# EAGLE design MAX1555_LiPo_Charger_Circuit_Ver02 (EAGLE 5.11)
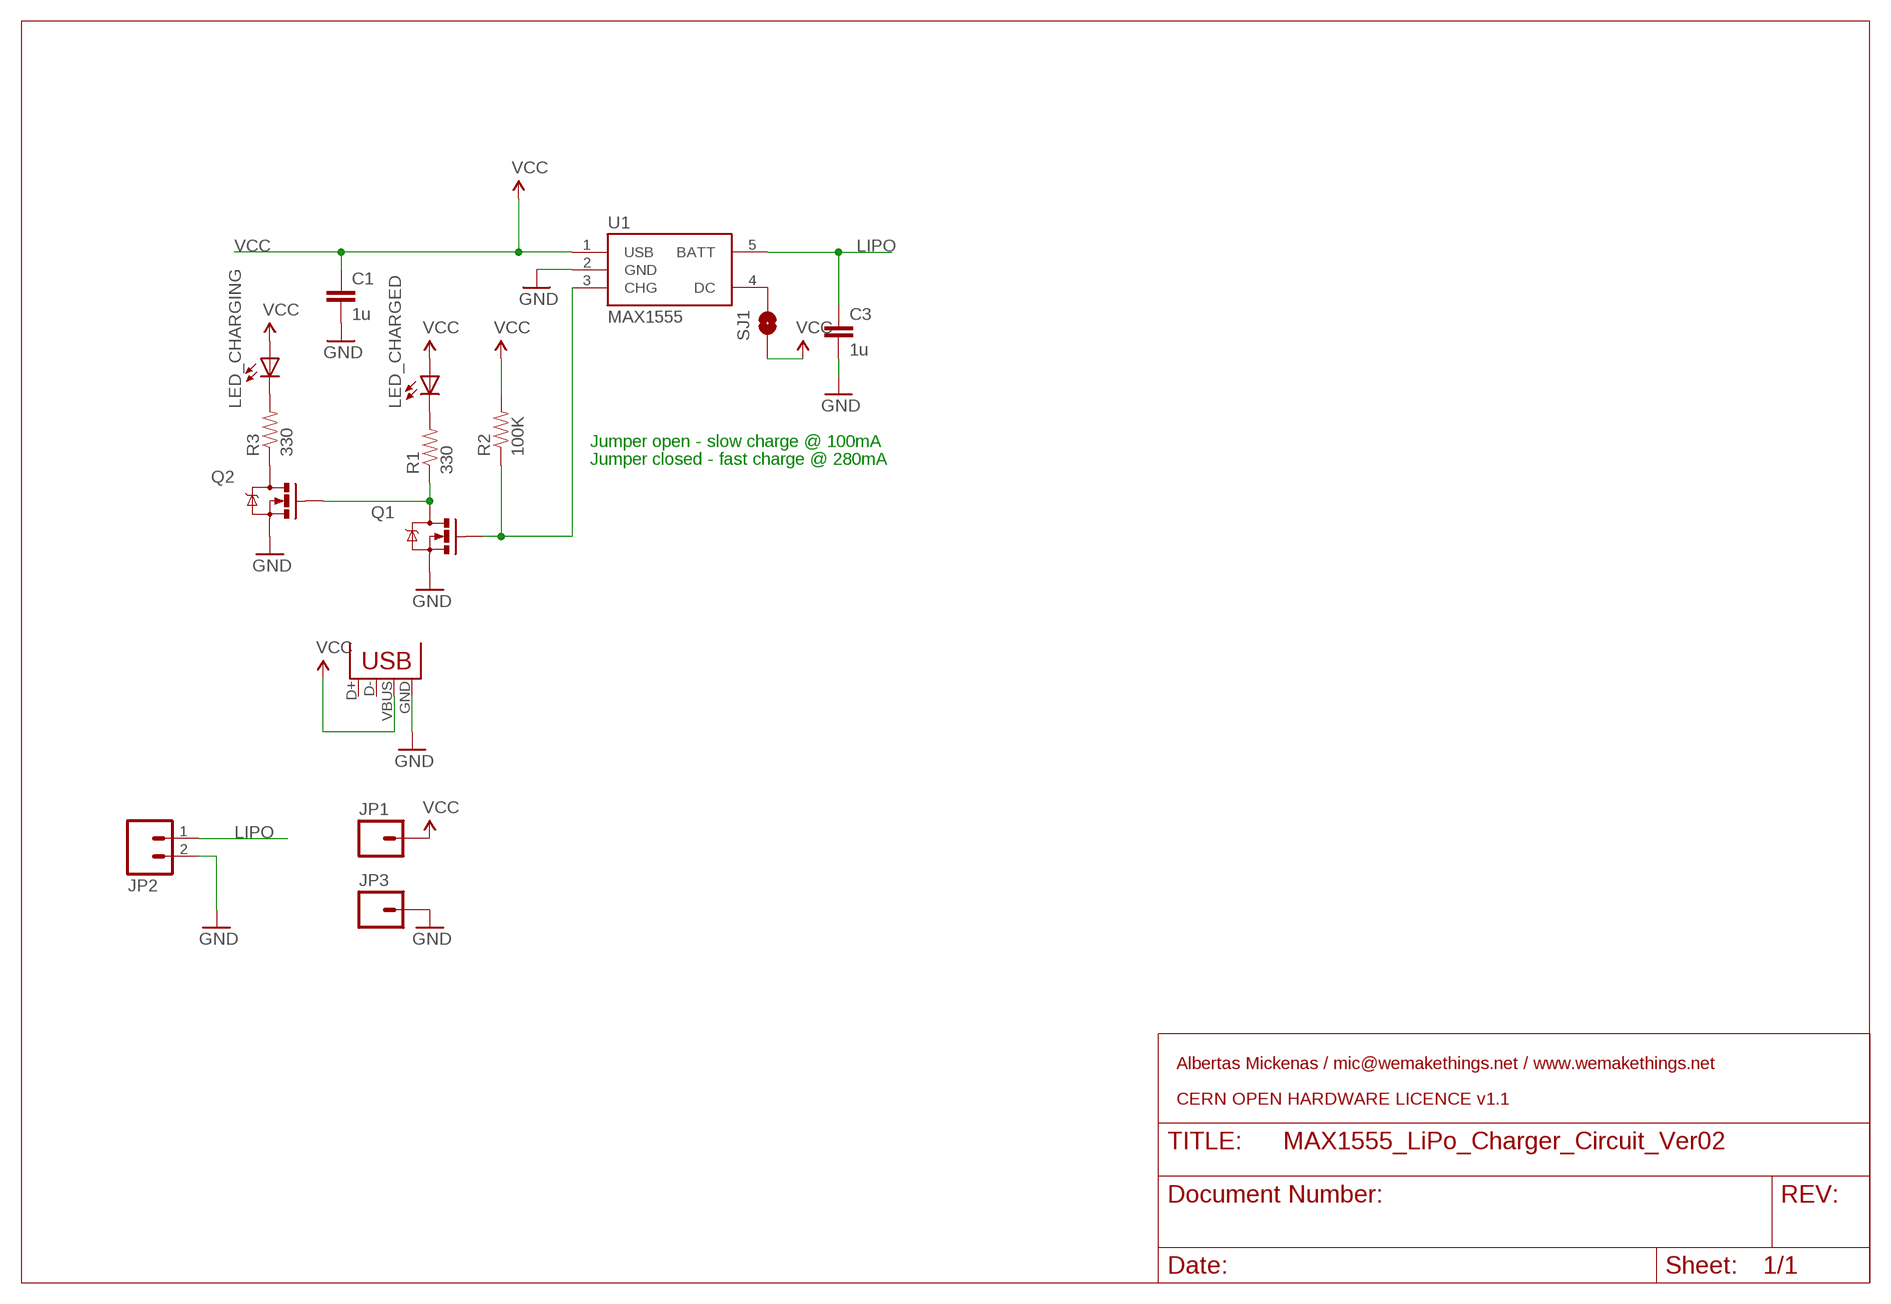
[diagram p0: schematic, sheet 1]

## Parts
C1  1u  CAP0805  [0805]
C3  1u  CAP0805  [0805]
JP1  M01PTH_LONGPAD  [1X01_LONGPAD]
JP2  M02LOCK_LONGPADS  [1X02_LOCK_LONGPADS]
JP3  M01PTH_LONGPAD  [1X01_LONGPAD]
LED_CHARGED  LEDCHIP-LED0805  [CHIP-LED0805]
LED_CHARGING  LEDCHIP-LED0805  [CHIP-LED0805]
Q1  MOSFET-NCHANNELSMD  [SOT23-3]
Q2  MOSFET-NCHANNELSMD  [SOT23-3]
R1  330  RESISTOR0603-RES  [0603-RES]
R2  100K  RESISTOR0603-RES  [0603-RES]
R3  330  RESISTOR0603-RES  [0603-RES]
SJ1  SOLDERJUMPERNC2  [SJ_2S-NOTRACE]
U1  MAX1555  [SOT23-5]
X1  USBOLD  [USB-MINIB-OLD]

## Nets
GND: C1.2 C3.2 JP2.2 JP3.1 Q1.2(S) Q2.2(S) U1.2(GND) X1.GND
LIPO: C3.1 JP2.1 U1.5(BATT)
N$1: Q1.1(G) R2.1 U1.3(CHG)
N$2: Q1.3(D) Q2.1(G) R1.1
N$3: LED_CHARGED.C R1.2
N$4: Q2.3(D) R3.1
N$5: LED_CHARGING.C R3.2
N$6: SJ1.2 U1.4(DC)
VCC: C1.1 JP1.1 LED_CHARGED.A LED_CHARGING.A R2.2 SJ1.1 U1.1(USB) X1.VBUS
Unconnected: X1.D+ X1.D-

## Notes on the sheet
- Jumper open - slow charge @ 100mA
- Jumper closed - fast charge @ 280mA
- Albertas Mickenas / mic@wemakethings.net / www.wemakethings.net
- CERN OPEN HARDWARE LICENCE v1.1

## Library data of the parts
C1 C3 = SparkFun:CAP: Capacitor Standard 0603 ceramic capacitor, and 0.1" leaded capacitor.
JP1 JP3 = SparkFun:M01: Header 1 Standard 1-pin 0.1" header. Use with straight break away headers (SKU : PRT-00116), right angle break away headers (PRT-00553), swiss pins (PRT-00743), machine pins (PRT-00117), and female headers (PRT-00115).
JP2 = SparkFun:M02: Header 2 Standard 2-pin 0.1" header. Use with straight break away headers (SKU : PRT-00116), right angle break away headers (PRT-00553), swiss pins (PRT-00743), machine pins (PRT-00117), and female headers (PRT-00115). Molex polarized connector foot print use with SKU : PRT-08233 with associated crimp pins and housings.
LED_CHARGED LED_CHARGING = adafruit:LED: LED OSRAM: - CHIPLED LG R971, LG N971, LY N971, LG Q971, LY Q971, LO R971, LY R971 LH N974, LH R974 LS Q976, LO Q976, LY Q976 LO Q996 - Hyper CHIPLED LW Q18S LB Q993, LB Q99A, LB R99A - SideLED LS A670, LO A670, LY A670, LG A670, LP A670 LB A673, LV A673, LT A673, LW A673 LH A674 LY A675 LS A676, LA A676, LO A676, LY A676, LW A676 LS A679, LY A679, LG A679 - Hyper Micro SIDELED® LS Y876, LA Y876, LO Y876, LY Y876 LT Y87S - SmartLED LW L88C, LW L88S LB L89C, LB L89S, LG L890 LS L89K, LO L89K, LY L89K LS L896, LA L896, LO L896, LY L896 - TOPLED LS T670, LO T670, LY T670, LG T670, LP T670 LSG T670, LSP T670, LSY T670, LOP T670, LYG T670 LG T671, LOG T671, LSG T671 LB T673, LV T673, LT T673, LW T673 LH T674 LS T676, LA T676, LO T676, LY T676, LB T676, LH T676, LSB T676, LW T676 LB T67C, LV T67C, LT T67C, LS T67K, LO T67K, LY T67K, LW E67C LS E67B, LA E67B, LO E67B, LY E67B, LB E67C, LV E67C, LT E67C LW T67C LS T679, LY T679, LG T679 LS T770, LO T770, LY T770, LG T770, LP T770 LB T773, LV T773, LT T773, LW T773 LH T774 LS E675, LA E675, LY E675, LS T675 LS T776, LA T776, LO T776, LY T776, LB T776 LHGB T686 LT T68C, LB T68C - Hyper Mini TOPLED® LB M676 - Mini TOPLED Santana® LG M470 LS M47K, LO M47K, LY M47K Source: http://www.osram.convergy.de/
Q1 Q2 = SparkFun:MOSFET-NCHANNEL
R1-R3 = SparkFun:RESISTOR: Resistor Basic schematic elements and footprints for 0603, 1206, and PTH resistors.
SJ1 = SparkFun:SOLDERJUMPER: Solder Jumper Standard SMD solder jumper. Used to automate production. Two varients : Normally Open and Normally Closed are the same, but have different paste layers. NC will have a large amount of paste and should jumper during reflow.
U1 = SparkFun:MAX1555: MAX1555 Lithium Charger IC SOT-23 Lithium Polymer charging IC. Schematic element and footprint proven. Spark Fun Electronics SKU : COM-00674
X1 = SparkFun:USB: USB Connectors USB-B-PTH is fully proven SKU : PRT-00139 USB-miniB is fully proven SKU : PRT-00587 USB-A-PCB is untested. USB-A-H is throughly reviewed, but untested. Spark Fun Electronics SKU : PRT-00437 USB-B-SMT is throughly reviewed, but untested. Needs silkscreen touching up. USB-A-S has not been used/tested USB-MB-H has not been used/tested

## Board
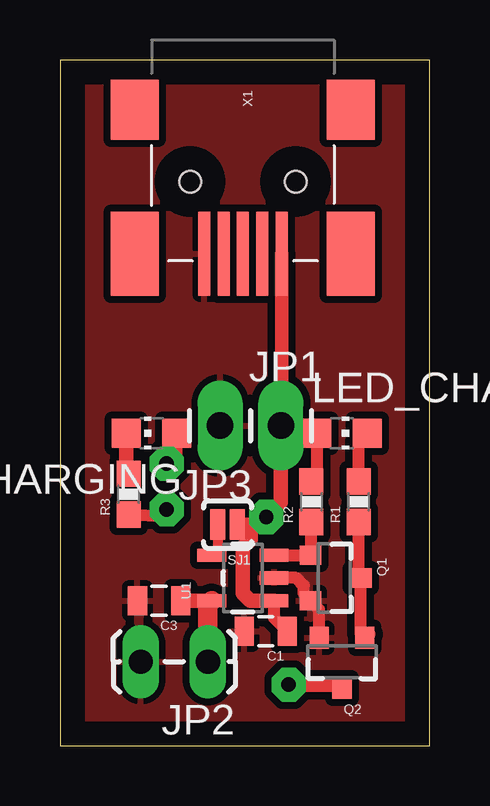
[diagram p1: board, top side]
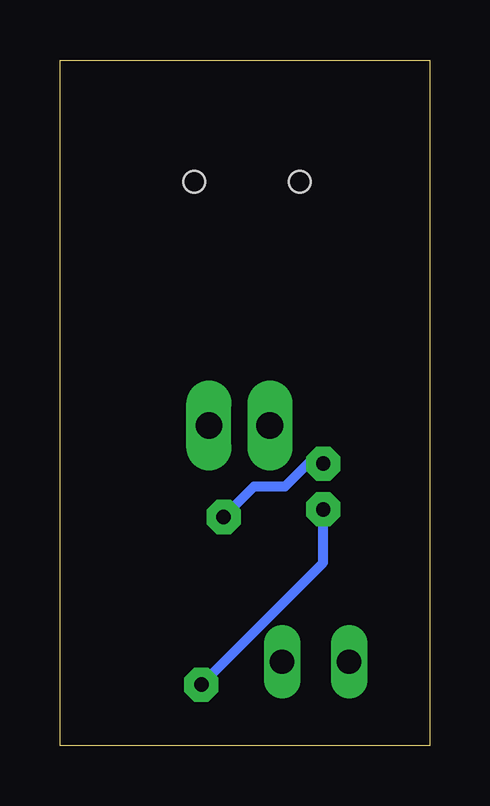
[diagram p2: board, bottom side, seen from below]

Size 15.41 x 28.57 mm. Coordinates in mm from the lower left corner, seen from the top.
Outline: 0,0 15.41,0 15.41,28.57 0,28.57 0,0
Copper layers (1*16): Top 0.035mm / dielectric 1.5mm / Bottom 0.035mm
Design rules "default": minimum track width 10mil, minimum drill 24mil, track to track 8mil, track to pad 8mil, pad to pad 8mil, via to via 8mil, smd to smd 8mil, copper to edge 40mil, drill to drill 8mil, minimum pad ring 10mil, minimum via ring 8mil, stop-mask expansion 4mil, vias tented up to drill 0mil, thermal gap 10mil

### Footprints (pad centres in the part's own frame; a part is rotated, then mirrored left to right if it is on the bottom)
0805 = smd 0.8 x 1.2: 1 -0.9,0; 2 0.9,0
1X01_LONGPAD = drill 1.118 pad 1.88 long: 1 0,0
1X02_LOCK_LONGPADS = drill 1.016 long: 1 -0.127,0; 2 2.667,0
CHIP-LED0805 = smd 1.2 x 1.2: A 0,-1.05; C 0,1.05
SOT23-3 = smd 0.8 x 0.9: 1 -0.95,-1; 2 0.95,-1; 3 0,1.1
0603-RES = smd 1.1 x 1: 1 -0.85,0; 2 0.85,0
SJ_2S-NOTRACE = smd 0.635 x 1.27: 1 -0.401,0; 2 0.413,0
SOT23-5 = smd 0.55 x 1.2: 1 -0.95,-1.3; 2 0,-1.3; 3 0.95,-1.3; 4 0.95,1.3; 5 -0.95,1.3
USB-MINIB-OLD = smd 2.5 x 2: 1 -3,-4.5; 2 -3,4.5 | smd 3.5 x 2: 3 3,-4.5; 4 3,4.5 | smd 3.5 x 0.5: D+ 3,0; D- 3,0.8; GND 3,-1.6; ID 3,-0.8; VBUS 3.01,1.61 | hole 0.9: 0,2.2; 0,-2.2

### Placement (x,y rotation side)
C1  8.57,4.76 180 top
C3  4.13,6.03 180 top
JP1  9.21,13.34 0 top
JP2  6.03,3.49 180 top
JP3  6.67,13.34 180 top
LED_CHARGED  11.75,13.02 270 top
LED_CHARGING  3.81,13.02 90 top
Q1  11.43,6.99 270 top
Q2  11.75,3.49 180 top
R1  12.45,10.16 90 top
R2  10.48,10.16 90 top
R3  2.86,10.48 90 top
SJ1  6.99,9.21 180 top
U1  7.62,6.99 90 top
X1  7.62,23.5 270 top

### Tracks (layer width: path | path; a pad name or v marks a point on that pad's centre or on a via)
GND
  Top 0.508: Q2.2 10.8,5.67 Q1.2 10.16,6.3 10.16,6.67 9.84,6.99 U1.2
  pour Top (isolate 0.305): -1.27,29.21 15.24,29.21 15.24,0 -1.27,0
LIPO
  Top 0.61: C3.1 U1.5
  Top 0.813: JP2.1 6.16,5.88 U1.5
N$1
  Top 0.508: R2.1 10.48,7.98 Q1.1 U1.3
N$2
  Top 0.508: Q2.1 12.53,4.66 Q1.3 12.45,7.07 R1.1
  Top 0.61: Q2.1 12.85,4.64
N$3
  Top 0.508: R1.2 12.45,12.67 LED_CHARGED.C
N$4  (via drill 0.6 pad 1.42)
  Top 0.508: R3.1 4.39,9.58 v4.45,9.84
  Top 0.61: v9.53,2.54 11.6,2.54 Q2.3
  Bottom 0.406: v9.53,2.54 4.45,7.62 v4.45,9.84
N$5
  Top 0.61: LED_CHARGING.C 2.76,11.47 R3.2
N$6
  Top 0.406: 6.35,7.93 U1.4 6.57,8.19 SJ1.2
VCC  (via drill 0.6 pad 1.42)
  Top 0.406: SJ1.1 7.39,8.81
  Top 0.508: LED_CHARGED.A 10.7,11.28 R2.2 | LED_CHARGING.A 4.86,11.85 v4.45,11.75 | U1.1 8.92,5.32 C1.1
  Top 0.559: X1.VBUS 9.23,12.72 9.21,12.7
  Top 0.61: U1.1 7.93,6.04 7.62,6.35 7.62,8.26 7.94,8.57 7.94,9.21 | 7.94,9.21 SJ1.1 | 7.94,9.21 8.28,9.21 v8.6,9.53 9.21,10.14 9.21,12.7 | 9.21,12.7 JP1.1 | LED_CHARGED.A 9.53,13.02 9.21,12.7
  Bottom 0.406: v8.6,9.53 7.33,10.79 6.03,10.79 5.08,11.75 v4.45,11.75